# Altium schematic sheet 40-主控板的原理图.SchDoc
size A3
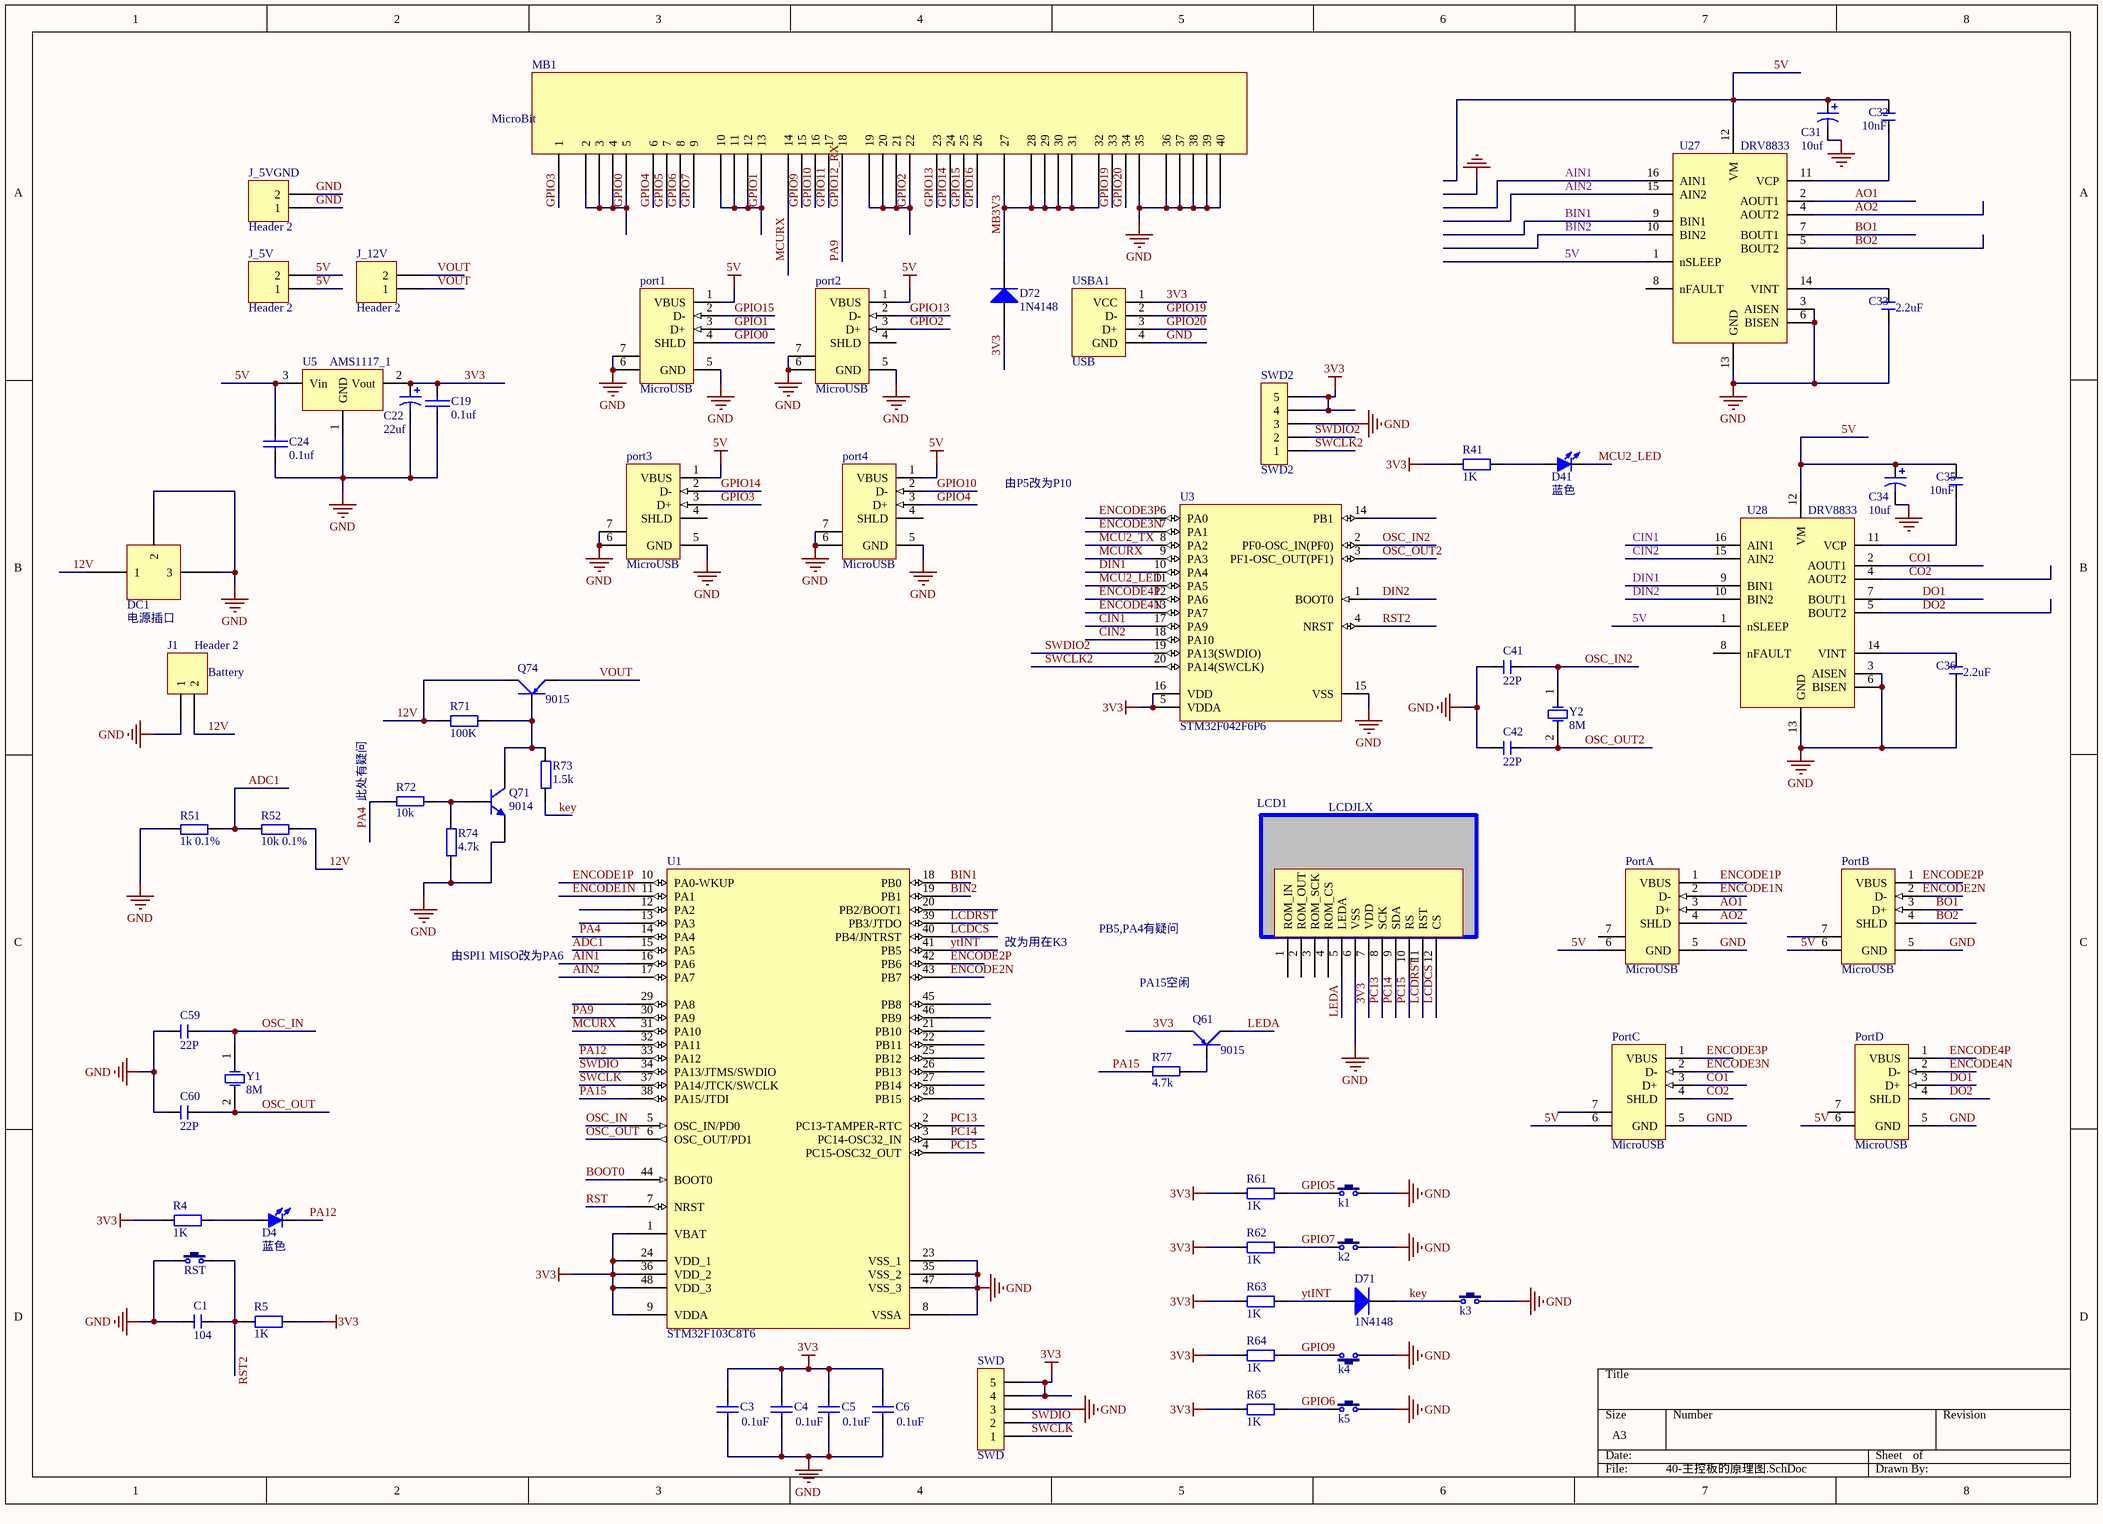
[diagram p0: 40-主控板的原理图.SchDoc]

## Parts
C1  104  [C0603]
C3  0.1uf  [C0603]
C4  0.1uf  [C0603]
C5  0.1uf  [C0603]
C6  0.1uf  [C0603]
C19  0.1uf  [LC-0603_C]
C22  22uf  [CD B(3528)]
C24  0.1uf  [LC-0603_C]
C31  10uf  [CD B(3528)]
C32  10nF  [C0603]
C33  2.2uF  [C0603]
C34  10uf  [CD B(3528)]
C35  10nF  [C0603]
C36  2.2uF  [C0603]
C41  22P  [C0603]
C42  22P  [C0603]
C59  22P  [C0603]
C60  22P  [C0603]
D4  蓝色  [D0603]
D41  蓝色  [D0603]
D71  1N4148  [SMD-IN4148]
D72  1N4148  [SMD-IN4148]
DC1  电源插口  [DC1]
J1  Header 2  [HDR1X2]
J_5V  Header 2  [HDR1X2]
J_5VGND  Header 2  [HDR1X2]
J_12V  Header 2  [HDR1X2]
k1  3x6x5  [key_4smd]  (value not drawn)
k2  3x6x5  [key_4smd]  (value not drawn)
k3  3x6x5  [key_4smd]  (value not drawn)
k4  3x6x5  [key_4smd]  (value not drawn)
k5  3x6x5  [key_4smd]  (value not drawn)
LCD1  LCDJLX  [LCDLJX-SHU]
MB1  MicroBit  [IDE1]
port1  MicroUSB  [USB/SM0.8-6H5]
port2  MicroUSB  [USB/SM0.8-6H5]
port3  MicroUSB  [USB/SM0.8-6H5]
port4  MicroUSB  [USB/SM0.8-6H5]
PortA  MicroUSB  [USB6P]
PortB  MicroUSB  [USB6P]
PortC  MicroUSB  [USB6P]
PortD  MicroUSB  [USB6P]
Q61  9015  [sot-23r]
Q71  9014  [sot-23r]
Q74  9015  [sot-23r]
R4  1K  [R0603]
R5  1K  [R0603]
R41  1K  [R0603]
R51  1k 0.1%  [R0603]
R52  10k 0.1%  [R0603]
R61  1K  [R0603]
R62  1K  [R0603]
R63  1K  [R0603]
R64  1K  [R0603]
R65  1K  [R0603]
R71  100K  [R0603]
R72  10k  [R0603]
R73  1.5k  [R0603]
R74  4.7k  [R0603]
R77  4.7k  [R0603]
RST  3x6x5  [key_4smd]  (value not drawn)
SWD  SWD  [HDR1X5]
SWD2  SWD2  [HDR1X5]
U1  STM32F103C8T6  [LQFP48 7X7_M]
U3  STM32F042F6P6  [STM-TSSOP20_N]
U5  AMS1117_1  [LC-SOT-223]
U27  DRV8833  [TSSOP16_M]
U28  DRV8833  [TSSOP16_M]
USBA1  USB  [USB-A]
Y1  8M  [XTAL_US]
Y2  8M  [XTAL_US]

## Nets
3V3: C3.2 C4.2 C5.2 C6.2 C19.2 C22.1 D72.1(A) LCD1.7(VDD) Q61.2(E) R4.1 R5.2 R41.1 R61.1 R62.1 R63.1 R64.1 R65.1 SWD.4 SWD.5 SWD2.4 SWD2.5 U1.1(VBAT) U1.9(VDDA) U1.24(VDD_1) U1.36(VDD_2) U1.48(VDD_3) U3.5(VDDA) U3.16(VDD) U5.2(Vout) USBA1.1(VCC)
5V: C24.2 C31.1 C32.2 C34.1 C35.2 J_5V.1 J_5V.2 port1.1(VBUS) port2.1(VBUS) port3.1(VBUS) port4.1(VBUS) PortA.6(SHLD) PortB.6(SHLD) PortC.6(SHLD) PortD.6(SHLD) U5.3(Vin) U27.1(nSLEEP) U27.12(VM) U28.1(nSLEEP) U28.12(VM)
GND: C1.1 C3.1 C4.1 C5.1 C6.1 C19.1 C22.2 C24.1 C31.2 C33.1 C34.2 C36.1 C41.1 C42.1 C59.1 C60.1 DC1.2 DC1.3 J1.1 J_5VGND.1 J_5VGND.2 k1.2 k2.2 k3.2 k4.1 k5.2 LCD1.6(VSS) MB1.35 MB1.36 MB1.37 MB1.38 MB1.39 MB1.40 port1.5(GND) port1.6(SHLD) port1.7(SHLD) port2.5(GND) port2.6(SHLD) port2.7(SHLD) port3.5(GND) port3.6(SHLD) port3.7(SHLD) port4.5(GND) port4.6(SHLD) port4.7(SHLD) PortA.5(GND) PortB.5(GND) PortC.5(GND) PortD.5(GND) Q71.2(E) R51.1 R74.1 RST.1 SWD.3 SWD2.3 U1.8(VSSA) U1.23(VSS_1) U1.35(VSS_2) U1.47(VSS_3) U3.15(VSS) U5.1(GND) U27.3(AISEN) U27.6(BISEN) U27.13(GND) U28.3(AISEN) U28.6(BISEN) U28.13(GND) USBA1.4(GND)
12V: DC1.1 J1.2 Q74.3(C) R52.2 R71.1
ADC1: R51.2 R52.1 U1.15(PA5)
AIN1: U1.16(PA6) U27.16(AIN1)
AIN2: U1.17(PA7) U27.15(AIN2)
AO1: PortA.3(D+) U27.2(AOUT1)
AO2: PortA.4(SHLD) U27.4(AOUT2)
BIN1: U1.18(PB0) U27.9(BIN1)
BIN2: U1.19(PB1) U27.10(BIN2)
BO1: PortB.3(D+) U27.7(BOUT1)
BO2: PortB.4(SHLD) U27.5(BOUT2)
BOOT0: U1.44(BOOT0)
CIN1: U3.17(PA9) U28.16(AIN1)
CIN2: U3.18(PA10) U28.15(AIN2)
CO1: PortC.3(D+) U28.2(AOUT1)
CO2: PortC.4(SHLD) U28.4(AOUT2)
DIN1: U3.10(PA4) U28.9(BIN1)
DIN2: U3.1(BOOT0) U28.10(BIN2)
DO1: PortD.3(D+) U28.7(BOUT1)
DO2: PortD.4(SHLD) U28.5(BOUT2)
ENCODE1N: PortA.2(D-) U1.11(PA1)
ENCODE1P: PortA.1(VBUS) U1.10(PA0-WKUP)
ENCODE2N: PortB.2(D-) U1.43(PB7)
ENCODE2P: PortB.1(VBUS) U1.42(PB6)
ENCODE3N: PortC.2(D-) U3.7(PA1)
ENCODE3P: PortC.1(VBUS) U3.6(PA0)
ENCODE4N: PortD.2(D-) U3.13(PA7)
ENCODE4P: PortD.1(VBUS) U3.12(PA6)
GPIO0: MB1.2 MB1.3 MB1.4 MB1.5 port1.4(SHLD)
GPIO1: MB1.10 MB1.11 MB1.12 MB1.13 port1.3(D+)
GPIO2: MB1.19 MB1.20 MB1.21 MB1.22 port2.3(D+)
GPIO3: MB1.1 port3.3(D+)
GPIO4: MB1.6 port4.3(D+)
GPIO5: k1.1 MB1.7 R61.2
GPIO6: k5.1 MB1.8 R65.2
GPIO7: k2.1 MB1.9 R62.2
GPIO9: k4.2 MB1.15 R64.2
GPIO10: MB1.16 port4.2(D-)
GPIO11: MB1.17
GPIO12_RX: MB1.18 U1.30(PA9)  [also labelled PA9]
GPIO13: MB1.23 port2.2(D-)
GPIO14: MB1.24 port3.2(D-)
GPIO15: MB1.25 port1.2(D-)
GPIO16: MB1.26
GPIO19: MB1.33 USBA1.2(D-)
GPIO20: MB1.34 USBA1.3(D+)
key: D71.2(K) k3.1 R73.1
LCDCS: LCD1.12(CS) U1.40(PB4/JNTRST)
LCDRST: LCD1.11(RST) U1.39(PB3/JTDO)
LEDA: LCD1.5(LEDA) Q61.3(C)
MB3V3: D72.2(K) MB1.27 MB1.28 MB1.29 MB1.30 MB1.31 MB1.32
MCU2_LED: D41.2(K) U3.11(PA5)
MCU2_TX: U3.8(PA2)
MCURX: MB1.14 U1.31(PA10) U3.9(PA3)
OSC_IN: C59.2 U1.5(OSC_IN/PD0) Y1.1(OSC1)
OSC_IN2: C41.2 U3.2(PF0-OSC_IN(PF0)) Y2.1(OSC1)
OSC_OUT: C60.2 U1.6(OSC_OUT/PD1) Y1.2(OSC2)
OSC_OUT2: C42.2 U3.3(PF1-OSC_OUT(PF1)) Y2.2(OSC2)
PA4: R72.2 U1.14(PA4)
PA12: D4.2(K) U1.33(PA12)
PA15: R77.2 U1.38(PA15/JTDI)
PC13: LCD1.8(SCK) U1.2(PC13-TAMPER-RTC)
PC14: LCD1.9(SDA) U1.3(PC14-OSC32_IN)
PC15: LCD1.10(RS) U1.4(PC15-OSC32_OUT)
RST: U1.7(NRST)
RST2: C1.2 R5.1 RST.2 U3.4(NRST)
SWCLK: SWD.1 U1.37(PA14/JTCK/SWCLK)
SWCLK2: SWD2.1 U3.20(PA14(SWCLK))
SWDIO: SWD.2 U1.34(PA13/JTMS/SWDIO)
SWDIO2: SWD2.2 U3.19(PA13(SWDIO))
VOUT: J_12V.1 J_12V.2 Q74.2(E)
ytINT: D71.1(A) R63.2 U1.41(PB5)
NetC32_1: C32.1 U27.11(VCP)
NetC33_2: C33.2 U27.14(VINT)
NetC35_1: C35.1 U28.11(VCP)
NetC36_2: C36.2 U28.14(VINT)
NetD4_1: D4.1(A) R4.2
NetD41_1: D41.1(A) R41.2
NetQ61_1: Q61.1(B) R77.1
NetQ71_1: Q71.1(B) R72.1 R74.2
NetQ71_3: Q71.3(C) Q74.1(B) R71.2 R73.2

Not connected (* = marked no-connect by the designer): LCD1 1(ROM_IN) 2(ROM_OUT) 3(ROM_SCK) 4(ROM_CS); port2 4(SHLD); port3 4(SHLD); port4 4(SHLD); PortA 7(SHLD); PortB 7(SHLD); PortC 7(SHLD); PortD 7(SHLD); U1 12(PA2) 13(PA3) 20(PB2/BOOT1) 21(PB10) 22(PB11) 25(PB12) 26(PB13) 27(PB14) 28(PB15) 29(PA8) 32(PA11) 45(PB8) 46(PB9); U3 14(PB1); U27 8(nFAULT); U28 8(nFAULT)

## Notes on the sheet
- 由P5改为P10
- (near J1) Battery
- (near R72) 此处有疑问
- 由SPI1 MISO改为PA6
- 改为用在K3
- PB5,PA4有疑问
- (near Q61) PA15空闲

## Library data of the parts
C1 C41 C42 C59 C60 = C: 无极性贴片电容; 版权归属: 源创客; BOM名称: 无极性贴片电容; 学习资源: www.ooocke.com
C3-C6 = Cap: Capacitor; Published: 8-Jun-2000; LatestRevisionDate: 17-Jul-2002; LatestRevisionNote: Re-released for DXP Platform.; PackageReference: RAD-0.3; Publisher: Altium Limited; Value: 0.1uF
C19 C24 = cap
C22 C31 C34 = Cap Pol2: Polarized Capacitor (Axial); Published: 8-Jun-2000; LatestRevisionDate: 17-Jul-2002; LatestRevisionNote: Re-released for DXP Platform.; PackageReference: POLAR0.8; Publisher: Altium Limited; PackageDescription: Polarized Capacitor; 2 Leads
C32 C33 C35 C36 = C: 无极性贴片电容
D4 D41 = LED-SMD: 贴片LED; 版权归属: 源创客; BOM名称: 贴片LED; 学习资源: www.ooocke.com
D71 D72 = Diode 1N4148: High Conductance Fast Diode; Published: 8-Jun-2000; LatestRevisionDate: 17-Jul-2002; LatestRevisionNote: Re-released for DXP Platform.; DatasheetDocument: 1997; PackageReference: DO-35; Publisher: Altium Limited; Code_JEDEC: DO-204-AH; ComponentLink1Description: Manufacturer Link; ComponentLink1URL: http://www.fairchildsemi.com/; ComponentLink2Description: Datasheet; ComponentLink2URL: http://www.fairchildsemi.com/ds/1N%2F1N4148.pdf
DC1 = power_port
J1 J_5V J_5VGND J_12V = Header 2: Header, 2-Pin; LatestRevisionDate: 17-Jul-2002; LatestRevisionNote: Re-released for DXP Platform.; Publisher: Altium Limited
k1-k5 RST = TSW 3x6: 3x6轻触开关; 版权归属: 源创客; BOM名称: 3x6轻触开关; 学习资源: www.ooocke.com
port1-port4 PortA PortB PortC PortD = 440478-2: USB 2.0, Right Angle, SMT, A Type, Receptacle, 5 Position, Black; ContactMaterial: Phosphor Bronze; ContactPlating: Gold (30) over Nickel; PCB_Layout: Complies with manufacturer's recommendation.; DrillSize: Corresponds to nominal value.; PanelGround: Without; Published: 15-Jul-2004; DatasheetDocument: 15-Nov-2002; PackageDocument: 15-Nov-2002; PackageReference: 440478; Publisher: Altium Limited; HousingMaterial: Thermoplastic; ComponentLink1Description: Manufacturer Link; ComponentLink1URL: http://www.tycoelectronics.com/; ComponentLink2Description: Packaging Specification; ComponentLink2URL: http://ecommas.tycoelectronics.com/commerce/DocumentDelivery/DDEController?Action=showdoc&DocId=Customer+Drawing%7F440478%7FB%7Fpdf%7FEnglish%7FC_440478_B.pdf
Q61 Q74 = PNP9015
Q71 = NPN: NPN Bipolar Transistor; Published: 8-Jun-2000; LatestRevisionDate: 17-Jul-2002; LatestRevisionNote: Re-released for DXP Platform.; PackageReference: TO-226; Publisher: Altium Limited; Code_JEDEC: TO-226-AA
R4 R5 R41 R61-R65 R71 = R: 贴片电阻; 版权归属: 源创客; BOM名称: 贴片电阻; 学习资源: www.ooocke.com
R51 R52 R72-R74 R77 = R
SWD SWD2 = Header 5: 5P接插件; 版权归属: 源创客; BOM名称: 5P接插件; 学习资源: www.ooocke.com
U1 = STM32F103C8T6: STM32 ARM-based 32-bit MCU with 64 Kbytes Flash, 48-pin LQFP, Industrial Temperature; Published: 30-May-2008; DatasheetVersion: rev6, Mar-2008; PackageVersion: Mar-2008; PackageReference: LQFP48; Publisher: Altium Limited; PackageDescription: 48-Pin Low-Profile Quad Flat Pack, 7 x 7 mm Body, 0.5 mm Pitch (LQFP48); ComponentLink1Description: Manufacturer Link; ComponentLink1URL: www.st.com/stm32; ComponentLink2Description: Datasheet; ComponentLink2URL: http://www.st.com/stonline/products/literature/ds/13587.pdf
U3 = STM32F030F4P6: ARM Cortex-M0 32-bit MCU, 16 KB Flash, 4 KB Internal RAM, 15 I/Os, 20-pin TSSOP, -40 to 85 degC, Tube; FLASH Size (Prog) (kB): 16; I/Os (High Current): 15; Internal RAM Size (kB): 4; Operating Frequency(F) (Processor speed) (MHz): 48; Supply Voltage(Vcc) min (V): 2.4; DatasheetVersion: Rev. 1; PackageVersion: Rev. 1, 11/2012; PackageReference: TSSOP20; PackageDescription: 20-Pin Thin Shrink Small Outline Package, 6.5 x 4.4 mm Body, 0.65 mm Pitch; Supplier 1: Digi-Key; Supplier Part Number 1: 497-14044-5-ND; Supplier 2: Newark; Supplier Part Number 2: 06X3648; Supplier 3: Mouser; Supplier Part Number 3: 511-STM32F030F4P6; Core: ARM Cortex-M0; Packing: Tube; Mounting Technology: Surface Mount; PartNumber: STM32F030F4P6; ComponentLink1Description: Manufacturer URL; ComponentLink1URL: http://www.st.com/web/en/home.html; ComponentLink2Description: Datasheet; ComponentLink2URL: http://www.st.com/st-web-ui/static/active/en/resource/technical/document/datasheet/DM00088500.pdf; ComponentLink3Description: Package Specification; ComponentLink3URL: http://www.st.com/st-web-ui/static/active/en/resource/technical/document/datasheet/DM00065136.pdf
U5 = AMS1117_1: 3.3V电压转换器AMS1117
U27 U28 = DRV8833_NEW: 双H-桥电机驱动; BOM名称: 串口转USB; 版权归属: 源创客; 学习资源: www.ooocke.com
Y1 Y2 = XTAL: Crystal Oscillator; Published: 8-Jun-2000; LatestRevisionDate: 17-Jul-2002; LatestRevisionNote: Re-released for DXP Platform.; PackageReference: R38; Publisher: Altium Limited